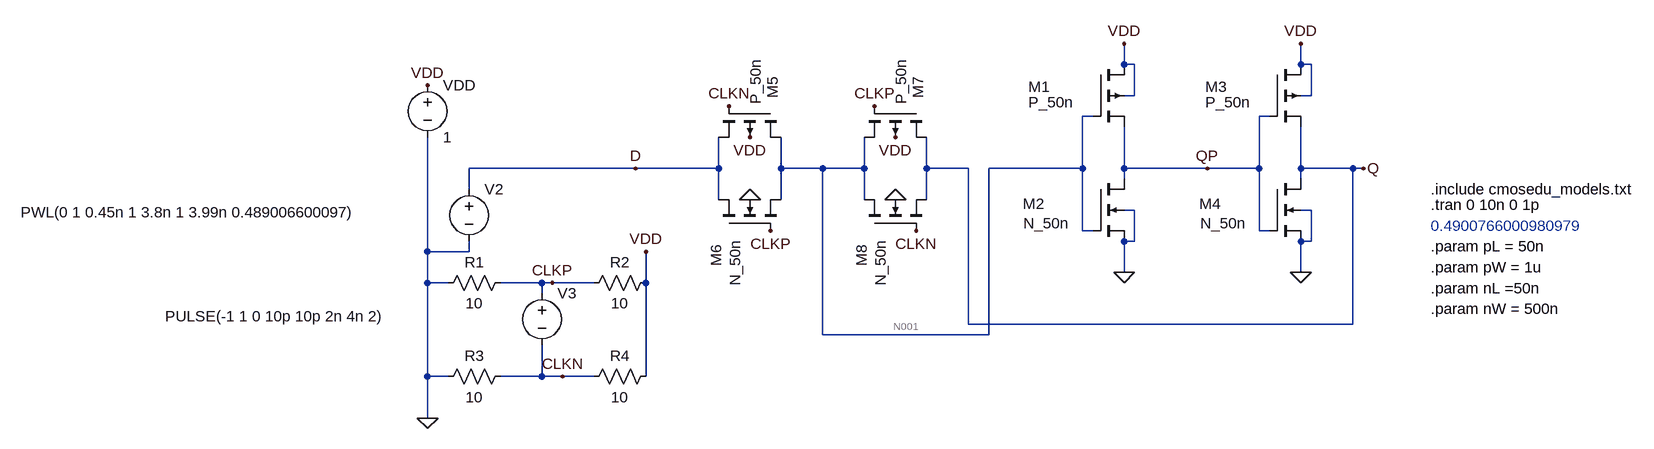
[diagram p0: schematic Metastability_d_Latch_success.asc]
Metastability_d_Latch_success.asc, the LTspice schematic file:
Version 4
SHEET 1 1404 812
WIRE 592 -624 592 -656
WIRE 608 -624 592 -624
WIRE 864 -624 864 -656
WIRE 880 -624 864 -624
WIRE 608 -576 608 -624
WIRE 608 -576 592 -576
WIRE 880 -576 880 -624
WIRE 880 -576 864 -576
WIRE 544 -544 528 -544
WIRE 816 -544 800 -544
WIRE -160 -464 -416 -464
WIRE -32 -464 -32 -512
WIRE -32 -464 -160 -464
WIRE 64 -464 64 -512
WIRE 128 -464 64 -464
WIRE 192 -464 192 -512
WIRE 192 -464 128 -464
WIRE 288 -464 288 -512
WIRE 352 -464 288 -464
WIRE 528 -464 528 -544
WIRE 528 -464 384 -464
WIRE 592 -464 592 -528
WIRE 720 -464 592 -464
WIRE 800 -464 800 -544
WIRE 800 -464 720 -464
WIRE 864 -464 864 -528
WIRE 944 -464 864 -464
WIRE 960 -464 944 -464
WIRE 592 -448 592 -464
WIRE 864 -448 864 -464
WIRE -416 -432 -416 -464
WIRE -32 -416 -32 -464
WIRE 64 -416 64 -464
WIRE 192 -416 192 -464
WIRE 288 -416 288 -464
WIRE 608 -400 592 -400
WIRE 880 -400 864 -400
WIRE 528 -368 528 -464
WIRE 544 -368 528 -368
WIRE 800 -368 800 -464
WIRE 816 -368 800 -368
WIRE 608 -352 608 -400
WIRE 608 -352 592 -352
WIRE 880 -352 880 -400
WIRE 880 -352 864 -352
WIRE -480 -336 -480 -512
WIRE -416 -336 -416 -352
WIRE -416 -336 -480 -336
WIRE 592 -304 592 -352
WIRE 864 -304 864 -352
WIRE -480 -288 -480 -336
WIRE -448 -288 -480 -288
WIRE -304 -288 -368 -288
WIRE -288 -288 -304 -288
WIRE -224 -288 -288 -288
WIRE -144 -288 -144 -336
WIRE -304 -272 -304 -288
WIRE 352 -224 352 -464
WIRE 944 -224 944 -464
WIRE 944 -224 352 -224
WIRE 128 -208 128 -464
WIRE 384 -208 384 -464
WIRE 384 -208 128 -208
WIRE -480 -144 -480 -288
WIRE -448 -144 -480 -144
WIRE -304 -144 -304 -192
WIRE -304 -144 -368 -144
WIRE -272 -144 -304 -144
WIRE -224 -144 -272 -144
WIRE -144 -144 -144 -288
WIRE -480 -80 -480 -144
FLAG -480 -80 0
FLAG -480 -592 VDD
FLAG -144 -336 VDD
FLAG -288 -288 CLKP
FLAG -272 -144 CLKN
FLAG 592 -656 VDD
FLAG 592 -304 0
FLAG 864 -656 VDD
FLAG 864 -304 0
FLAG 960 -464 Q
FLAG 720 -464 QP
FLAG 16 -416 0
FLAG 16 -512 VDD
FLAG -16 -560 CLKN
FLAG 48 -368 CLKP
FLAG 240 -416 0
FLAG 240 -512 VDD
FLAG 208 -560 CLKP
FLAG 272 -368 CLKN
FLAG -160 -464 D
SYMBOL voltage -480 -608 R0
WINDOW 123 0 0 Left 0
WINDOW 39 0 0 Left 0
SYMATTR InstName VDD
SYMATTR Value 1
SYMBOL voltage -416 -448 R0
WINDOW 3 -690 51 Left 2
WINDOW 123 0 0 Left 0
WINDOW 39 0 0 Left 0
SYMATTR Value PWL(0 1 0.45n 1 3.8n 1 3.99n 0.489006600097)
SYMATTR InstName V2
SYMBOL voltage -304 -288 R0
WINDOW 3 -580 51 Left 2
WINDOW 123 0 0 Left 0
WINDOW 39 0 0 Left 0
SYMATTR Value PULSE(-1 1 0 10p 10p 2n 4n 2)
SYMATTR InstName V3
SYMBOL res -352 -304 R90
WINDOW 0 0 56 VBottom 2
WINDOW 3 32 56 VTop 2
SYMATTR InstName R1
SYMATTR Value 10
SYMBOL res -128 -304 R90
WINDOW 0 0 56 VBottom 2
WINDOW 3 32 56 VTop 2
SYMATTR InstName R2
SYMATTR Value 10
SYMBOL res -352 -160 R90
WINDOW 0 0 56 VBottom 2
WINDOW 3 32 56 VTop 2
SYMATTR InstName R3
SYMATTR Value 10
SYMBOL res -128 -160 R90
WINDOW 0 0 56 VBottom 2
WINDOW 3 32 56 VTop 2
SYMATTR InstName R4
SYMATTR Value 10
SYMBOL pmos4 544 -624 R0
WINDOW 0 -99 34 Left 2
WINDOW 3 -99 58 Left 2
SYMATTR InstName M1
SYMATTR Value P_50n
SYMATTR Value2 l={pL} w={pW}
SYMBOL nmos4 544 -448 R0
WINDOW 0 -108 38 Left 2
WINDOW 3 -107 68 Left 2
SYMATTR InstName M2
SYMATTR Value N_50n
SYMATTR Value2 l={nL} w={nW}
SYMBOL pmos4 816 -624 R0
WINDOW 0 -99 34 Left 2
WINDOW 3 -99 58 Left 2
SYMATTR InstName M3
SYMATTR Value P_50n
SYMATTR Value2 l={pL} w={pW}
SYMBOL nmos4 816 -448 R0
WINDOW 0 -108 38 Left 2
WINDOW 3 -107 68 Left 2
SYMATTR InstName M4
SYMATTR Value N_50n
SYMATTR Value2 l={nL} w={nW}
SYMBOL pmos4 64 -560 R90
WINDOW 0 -45 13 Left 2
WINDOW 3 -72 39 Left 2
SYMATTR InstName M5
SYMATTR Value P_50n
SYMATTR Value2 l={pL} w={pW}
SYMBOL nmos4 -32 -368 R270
WINDOW 0 -55 -4 Left 2
WINDOW 3 -85 25 Left 2
SYMATTR InstName M6
SYMATTR Value N_50n
SYMATTR Value2 l={nL} w={nW}
SYMBOL pmos4 288 -560 R90
WINDOW 0 -45 13 Left 2
WINDOW 3 -72 39 Left 2
SYMATTR InstName M7
SYMATTR Value P_50n
SYMATTR Value2 l={pL} w={pW}
SYMBOL nmos4 192 -368 R270
WINDOW 0 -55 -4 Left 2
WINDOW 3 -85 25 Left 2
SYMATTR InstName M8
SYMATTR Value N_50n
SYMATTR Value2 l={nL} w={nW}
TEXT 1064 -432 Left 2 !.include cmosedu_models.txt
TEXT 1064 -408 Left 2 !.tran 0 10n 0 1p
TEXT 1064 -344 Left 2 !.param pL = 50n
TEXT 1064 -312 Left 2 !.param pW = 1u
TEXT 1064 -280 Left 2 !.param nL =50n
TEXT 1064 -248 Left 2 !.param nW = 500n
TEXT 1064 -376 Left 2 ;0.4900766000980979

The netlist it stands for:
* Metastability_d_Latch_success.asc
VDD VDD 0 1
V2 D 0 PWL(0 1 0.45n 1 3.8n 1 3.99n 0.489006600097)
V3 CLKP CLKN PULSE(-1 1 0 10p 10p 2n 4n 2)
R1 CLKP 0 10
R2 VDD CLKP 10
R3 CLKN 0 10
R4 VDD CLKN 10
M1 VDD N001 QP VDD P_50n l={pL} w={pW}
M2 QP N001 0 0 N_50n l={nL} w={nW}
M3 VDD QP Q VDD P_50n l={pL} w={pW}
M4 Q QP 0 0 N_50n l={nL} w={nW}
M5 N001 CLKN D VDD P_50n l={pL} w={pW}
M6 D CLKP N001 0 N_50n l={nL} w={nW}
M7 Q CLKP N001 VDD P_50n l={pL} w={pW}
M8 N001 CLKN Q 0 N_50n l={nL} w={nW}
.model NMOS NMOS
.model PMOS PMOS
.lib standard.mos
.include cmosedu_models.txt
.tran 0 10n 0 1p
.param pL = 50n
.param pW = 1u
.param nL =50n
.param nW = 500n
* 0.4900766000980979
.backanno
.end

* Results of the author's LTspice run, read from the files saved beside the schematic
* Operating Point, zero values left out:
*   V(vdd) = 1 V
*   V(d) = 1 V
*   V(clkp) = -30.66 nV
*   V(clkn) = 1 V
*   V(n001) = 104 µV
*   V(qp) = 1 V
*   V(q) = 62.25 µV
*   Id(M8) = 39.04 nA
*   Ig(M8) = 1.746 nA
*   Ib(M8) = -32.91 pA
*   Is(M8) = -40.76 nA
*   Id(M6) = 3.633 nA
*   Ig(M6) = -621 pA
*   Ib(M6) = -1 pA
*   Is(M6) = -3.011 nA
*   Id(M4) = 58.62 nA
*   Ig(M4) = 1.746 nA
*   Ib(M4) = -32.92 pA
*   Is(M4) = -60.33 nA
*   Id(M2) = 3.652 nA
*   Ig(M2) = -620.6 pA
*   Ib(M2) = -1 pA
*   Is(M2) = -3.031 nA
*   Id(M7) = -1.041 pA
*   Ib(M7) = 2.007 pA
*   Id(M5) = -17.85 nA
*   Ig(M5) = 11.14 nA
*   Ib(M5) = 1 pA
*   Is(M5) = 6.715 nA
*   Id(M3) = 6.721 nA
*   Ig(M3) = 11.14 nA
*   Ib(M3) = 1 pA
*   Is(M3) = -17.86 nA
*   Id(M1) = 33.96 nA
*   Ig(M1) = -17.56 nA
*   Ib(M1) = 139.1 pA
*   Is(M1) = -16.54 nA
*   I(R4) = 3.066 nA
*   I(R3) = 100 mA
*   I(R2) = 100 mA
*   I(R1) = -3.066 nA
*   I(V3) = 100 mA
*   I(V2) = -10.35 nA
*   I(Vdd) = -100 mA
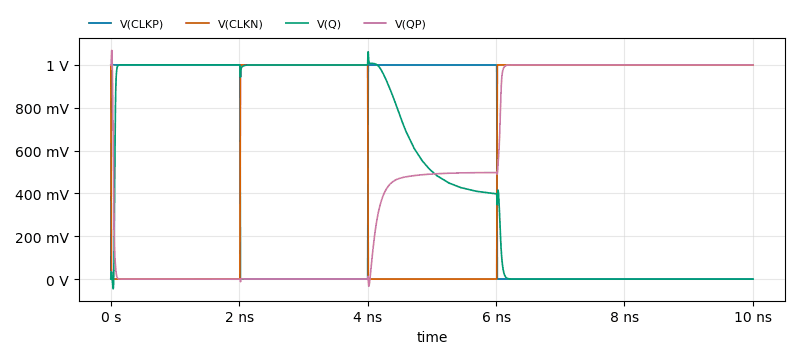
[diagram p1: Transient Analysis of Metastability_d_Latch_success.asc, plotted from the saved traces]
* Transient Analysis, 1 run:
*   V(CLKP): min -74.69 µV, max 1.001 V, average 402 mV, rms 633.5 mV, last 0 V
*   V(CLKN): min -277.5 µV, max 1 V, average 598 mV, rms 772.9 mV, last 1 V
*   V(Q): min -45.3 mV, max 1.061 V, average 516.8 mV, rms 689.3 mV, last 54.05 µV
*   V(QP): min -33.29 mV, max 1.068 V, average 491.3 mV, rms 664.3 mV, last 1 V